# Altium schematic sheet module.SchDoc
size A4
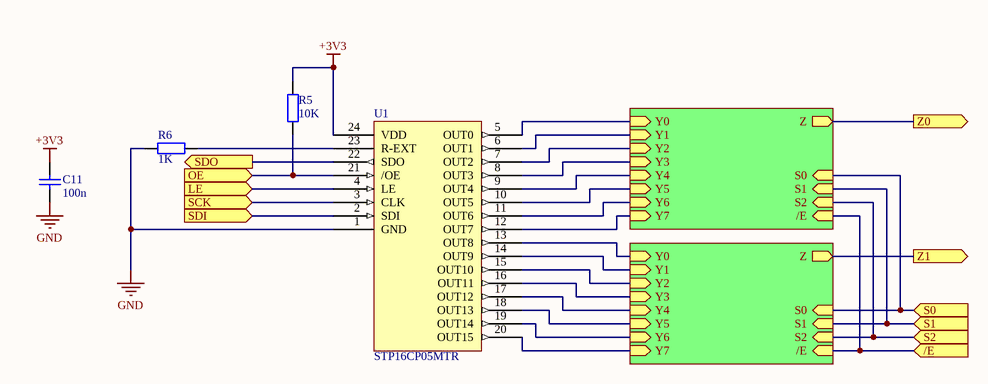
[diagram p0: module.SchDoc]

## Parts
C11  100n  [FP_0805_CAP_085]
R5  10K  [FP_0805_RES]
R6  1K  [FP_0805_RES]
U1  STP16CP05MTR  [SOP24]

## Sub-sheets
U_tcrt_mux = tcrt_mux.SchDoc: S0 (in), S1 (in), S2 (in), /E (in), Z (out), Y0 (in), Y1 (in), Y2 (in), Y3 (in), Y4 (in), Y5 (in), Y6 (in), Y7 (in)
U_tcrt_mux = tcrt_mux.SchDoc: S0 (in), S1 (in), S2 (in), /E (in), Z (out), Y0 (in), Y1 (in), Y2 (in), Y3 (in), Y4 (in), Y5 (in), Y6 (in), Y7 (in)

## Ports
/E (in), LE (in), OE (in), S0 (in), S1 (in), S2 (in), SCK (in), SDI (in), SDO (out), Z0 (out), Z1 (out)

## Nets
+3V3: C11.2 R5.2 U1.24(VDD)
GND: C11.1 R6.2 U1.1(GND)
/E: port /E, sheet U_tcrt_mux//E, sheet U_tcrt_mux//E
LE: U1.4(LE) ; port LE
OE: R5.1 U1.21(/OE) ; port OE
S0: port S0, sheet U_tcrt_mux/S0, sheet U_tcrt_mux/S0
S1: port S1, sheet U_tcrt_mux/S1, sheet U_tcrt_mux/S1
S2: port S2, sheet U_tcrt_mux/S2, sheet U_tcrt_mux/S2
SCK: U1.3(CLK) ; port SCK
SDI: U1.2(SDI) ; port SDI
SDO: U1.22(SDO) ; port SDO
Z0: port Z0, sheet U_tcrt_mux/Z
Z1: port Z1, sheet U_tcrt_mux/Z
NetR6_1: R6.1 U1.23(R-EXT)
NetU1_5: U1.5(OUT0) ; sheet U_tcrt_mux/Y0
NetU1_6: U1.6(OUT1) ; sheet U_tcrt_mux/Y1
NetU1_7: U1.7(OUT2) ; sheet U_tcrt_mux/Y2
NetU1_8: U1.8(OUT3) ; sheet U_tcrt_mux/Y3
NetU1_9: U1.9(OUT4) ; sheet U_tcrt_mux/Y4
NetU1_10: U1.10(OUT5) ; sheet U_tcrt_mux/Y5
NetU1_11: U1.11(OUT6) ; sheet U_tcrt_mux/Y6
NetU1_12: U1.12(OUT7) ; sheet U_tcrt_mux/Y7
NetU1_13: U1.13(OUT8) ; sheet U_tcrt_mux/Y0
NetU1_14: U1.14(OUT9) ; sheet U_tcrt_mux/Y1
NetU1_15: U1.15(OUT10) ; sheet U_tcrt_mux/Y2
NetU1_16: U1.16(OUT11) ; sheet U_tcrt_mux/Y3
NetU1_17: U1.17(OUT12) ; sheet U_tcrt_mux/Y4
NetU1_18: U1.18(OUT13) ; sheet U_tcrt_mux/Y5
NetU1_19: U1.19(OUT14) ; sheet U_tcrt_mux/Y6
NetU1_20: U1.20(OUT15) ; sheet U_tcrt_mux/Y7

## Library data of the parts
C11 = CAP: Capacitor; Value: 100n
R5 R6 = RES: Resistor
  R5: Value: 10K
  R6: Value: 1K
U1 = STP16CP05MTR: ComponentLink1Description: Farnell; ComponentLink1URL: https://hu.farnell.com/stmicroelectronics/stp16cp05mtr/ic-sm-driver-led-sink-16-bit/dp/1542235